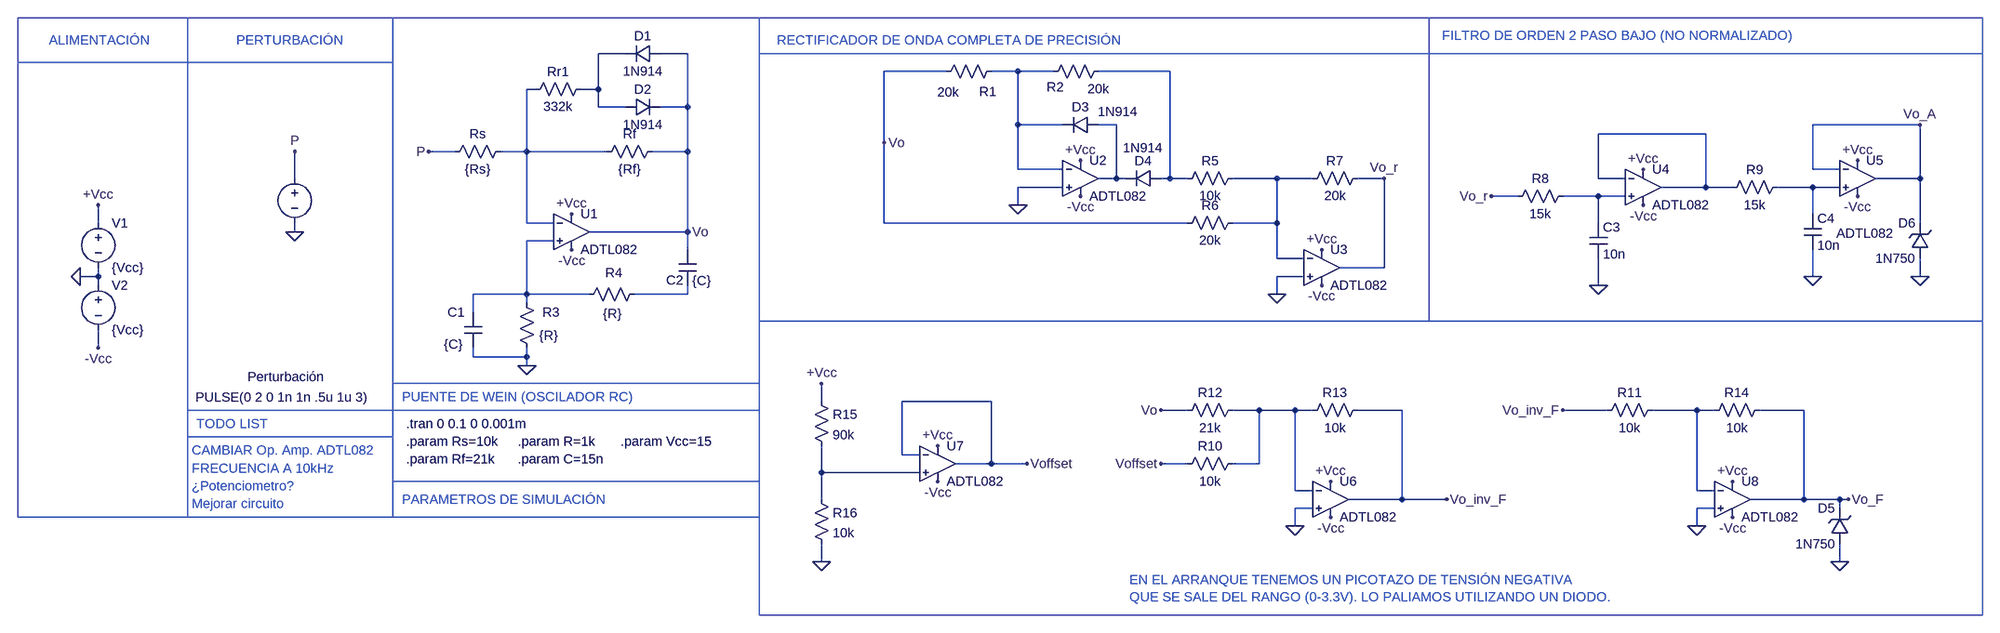
[diagram p0: schematic Circuito_Oscilador.asc]
Circuito_Oscilador.asc, the LTspice schematic file:
Version 4
SHEET 1 4436 1040
WIRE 432 -160 384 -160
WIRE 544 -160 496 -160
WIRE 1008 -128 896 -128
WIRE 1136 -128 1088 -128
WIRE 1200 -128 1136 -128
WIRE 1408 -128 1280 -128
WIRE 272 -96 256 -96
WIRE 384 -96 384 -160
WIRE 384 -96 352 -96
WIRE 384 -64 384 -96
WIRE 432 -64 384 -64
WIRE 544 -64 544 -160
WIRE 544 -64 496 -64
WIRE 1136 -32 1136 -128
WIRE 1216 -32 1136 -32
WIRE 1312 -32 1280 -32
WIRE 2752 -32 2560 -32
WIRE 2368 -16 2176 -16
WIRE 896 0 896 -128
WIRE 128 16 80 16
WIRE 256 16 256 -96
WIRE 256 16 208 16
WIRE 400 16 256 16
WIRE 544 16 544 -64
WIRE 544 16 480 16
WIRE 1136 48 1136 -32
WIRE 1216 48 1136 48
WIRE 2560 48 2560 -32
WIRE 2608 48 2560 48
WIRE -160 64 -160 16
WIRE 1312 64 1312 -32
WIRE 1312 64 1280 64
WIRE 1328 64 1312 64
WIRE 1408 64 1408 -128
WIRE 1408 64 1392 64
WIRE 1440 64 1408 64
WIRE 1600 64 1520 64
WIRE 1664 64 1600 64
WIRE 1792 64 1744 64
WIRE 2176 64 2176 -16
WIRE 2224 64 2176 64
WIRE 2752 64 2752 -32
WIRE 2752 64 2672 64
WIRE 1216 80 1136 80
WIRE 2368 80 2368 -16
WIRE 2368 80 2288 80
WIRE 2416 80 2368 80
WIRE 2560 80 2496 80
WIRE 2608 80 2560 80
WIRE 2032 96 1984 96
WIRE 2176 96 2112 96
WIRE 2224 96 2176 96
WIRE 1136 112 1136 80
WIRE 2560 128 2560 80
WIRE -512 144 -512 112
WIRE 256 144 256 16
WIRE 304 144 256 144
WIRE 896 144 896 0
WIRE 1440 144 896 144
WIRE 1600 144 1600 64
WIRE 1600 144 1520 144
WIRE 2176 144 2176 96
WIRE 2752 144 2752 64
WIRE -160 160 -160 144
WIRE 544 160 544 16
WIRE 544 160 368 160
WIRE 304 176 256 176
WIRE 544 192 544 160
WIRE 1600 208 1600 144
WIRE 1648 208 1600 208
WIRE 1792 224 1792 64
WIRE 1792 224 1712 224
WIRE -512 240 -512 224
WIRE -512 240 -544 240
WIRE 1648 240 1600 240
WIRE 2560 240 2560 192
WIRE 2752 240 2752 208
WIRE -512 256 -512 240
WIRE 2176 256 2176 208
WIRE 256 272 256 176
WIRE 256 272 160 272
WIRE 368 272 256 272
WIRE 544 272 544 256
WIRE 544 272 448 272
WIRE 1600 272 1600 240
WIRE 256 288 256 272
WIRE 160 304 160 272
WIRE -512 368 -512 336
WIRE 160 384 160 368
WIRE 256 384 256 368
WIRE 256 384 160 384
WIRE 256 400 256 384
WIRE 784 464 784 432
WIRE 1088 464 928 464
WIRE 1440 480 1392 480
WIRE 1568 480 1520 480
WIRE 1632 480 1568 480
WIRE 1664 480 1632 480
WIRE 1824 480 1744 480
WIRE 2192 480 2112 480
WIRE 2352 480 2272 480
WIRE 2384 480 2352 480
WIRE 2544 480 2464 480
WIRE 928 560 928 464
WIRE 960 560 928 560
WIRE 1088 576 1088 464
WIRE 1088 576 1024 576
WIRE 1152 576 1088 576
WIRE 1440 576 1392 576
WIRE 1568 576 1568 480
WIRE 1568 576 1520 576
WIRE 784 592 784 544
WIRE 960 592 784 592
WIRE 1632 624 1632 480
WIRE 1664 624 1632 624
WIRE 2352 624 2352 480
WIRE 2384 624 2352 624
WIRE 784 640 784 592
WIRE 1824 640 1824 480
WIRE 1824 640 1728 640
WIRE 1904 640 1824 640
WIRE 2544 640 2544 480
WIRE 2544 640 2448 640
WIRE 2608 640 2544 640
WIRE 2624 640 2608 640
WIRE 1664 656 1632 656
WIRE 2384 656 2352 656
WIRE 2608 656 2608 640
WIRE 1632 688 1632 656
WIRE 2352 688 2352 656
WIRE 784 752 784 720
WIRE 2608 752 2608 720
FLAG -544 240 0
FLAG -512 112 +Vcc
FLAG -512 368 -Vcc
FLAG 336 192 -Vcc
FLAG 336 128 +Vcc
FLAG 256 400 0
FLAG 544 160 Vo
FLAG -160 160 0
FLAG 80 16 P
FLAG -160 16 P
FLAG 1600 272 0
FLAG 1136 112 0
FLAG 1248 32 +Vcc
FLAG 1248 96 -Vcc
FLAG 1680 192 +Vcc
FLAG 1680 256 -Vcc
FLAG 1792 64 Vo_r
FLAG 2176 256 0
FLAG 2560 240 0
FLAG 2256 48 +Vcc
FLAG 2256 112 -Vcc
FLAG 2640 32 +Vcc
FLAG 2640 96 -Vcc
FLAG 1984 96 Vo_r
FLAG 2752 -32 Vo_A
FLAG 896 0 Vo
FLAG 1696 672 -Vcc
FLAG 1696 608 +Vcc
FLAG 1632 688 0
FLAG 992 608 -Vcc
FLAG 992 544 +Vcc
FLAG 784 752 0
FLAG 784 432 +Vcc
FLAG 1152 576 Voffset
FLAG 1392 576 Voffset
FLAG 1392 480 Vo
FLAG 1904 640 Vo_inv_F
FLAG 2416 672 -Vcc
FLAG 2416 608 +Vcc
FLAG 2352 688 0
FLAG 2624 640 Vo_F
FLAG 2112 480 Vo_inv_F
FLAG 2608 752 0
FLAG 2752 240 0
SYMBOL voltage -512 128 R0
WINDOW 123 0 0 Left 0
WINDOW 39 0 0 Left 0
SYMATTR InstName V1
SYMATTR Value {Vcc}
SYMBOL voltage -512 240 R0
WINDOW 123 0 0 Left 0
WINDOW 39 0 0 Left 0
SYMATTR InstName V2
SYMATTR Value {Vcc}
SYMBOL res 224 0 R90
WINDOW 0 0 56 VBottom 2
WINDOW 3 32 56 VTop 2
SYMATTR InstName Rs
SYMATTR Value {Rs}
SYMBOL res 496 0 R90
WINDOW 0 0 56 VBottom 2
WINDOW 3 32 56 VTop 2
SYMATTR InstName Rf
SYMATTR Value {Rf}
SYMBOL res 240 272 R0
WINDOW 0 44 32 Left 2
WINDOW 3 38 74 Left 2
SYMATTR InstName R3
SYMATTR Value {R}
SYMBOL cap 144 304 R0
WINDOW 0 -30 0 Left 2
WINDOW 3 -37 58 Left 2
SYMATTR InstName C1
SYMATTR Value {C}
SYMBOL cap 528 192 R0
WINDOW 0 -22 55 Left 2
SYMATTR InstName C2
SYMATTR Value {C}
SYMBOL res 464 256 R90
WINDOW 0 -7 52 VBottom 2
WINDOW 3 35 55 VTop 2
SYMATTR InstName R4
SYMATTR Value {R}
SYMBOL voltage -160 48 R0
WINDOW 0 -84 372 Left 2
WINDOW 3 -178 409 Left 2
WINDOW 123 0 0 Left 0
WINDOW 39 0 0 Left 0
SYMATTR InstName Perturbación
SYMATTR Value PULSE(0 2 0 1n 1n .5u 1u 3)
SYMBOL res 368 -112 R90
WINDOW 0 0 56 VBottom 2
WINDOW 3 32 56 VTop 2
SYMATTR InstName Rr1
SYMATTR Value 332k
SYMBOL diode 496 -176 R90
WINDOW 0 0 32 VBottom 2
WINDOW 3 32 32 VTop 2
SYMATTR InstName D1
SYMATTR Value 1N914
SYMBOL diode 432 -48 R270
WINDOW 0 32 32 VTop 2
WINDOW 3 0 32 VBottom 2
SYMATTR InstName D2
SYMATTR Value 1N914
SYMBOL OpAmps\\ADTL082 336 96 R0
SYMATTR InstName U1
SYMBOL OpAmps\\ADTL082 1248 0 R0
SYMATTR InstName U2
SYMBOL OpAmps\\ADTL082 1680 160 R0
SYMATTR InstName U3
SYMBOL res 1104 -144 R90
WINDOW 0 68 22 VBottom 2
WINDOW 3 38 93 VTop 2
SYMATTR InstName R1
SYMATTR Value 20k
SYMBOL res 1296 -144 R90
WINDOW 0 60 93 VBottom 2
WINDOW 3 32 16 VTop 2
SYMATTR InstName R2
SYMATTR Value 20k
SYMBOL res 1536 48 R90
WINDOW 0 0 56 VBottom 2
WINDOW 3 32 56 VTop 2
SYMATTR InstName R5
SYMATTR Value 10k
SYMBOL res 1536 128 R90
WINDOW 0 0 56 VBottom 2
WINDOW 3 32 56 VTop 2
SYMATTR InstName R6
SYMATTR Value 20k
SYMBOL res 1760 48 R90
WINDOW 0 0 56 VBottom 2
WINDOW 3 32 56 VTop 2
SYMATTR InstName R7
SYMATTR Value 20k
SYMBOL diode 1280 -48 R90
WINDOW 0 0 32 VBottom 2
WINDOW 3 -23 -35 VTop 2
SYMATTR InstName D3
SYMATTR Value 1N914
SYMBOL diode 1392 48 R90
WINDOW 0 0 32 VBottom 2
WINDOW 3 -54 32 VTop 2
SYMATTR InstName D4
SYMATTR Value 1N914
SYMBOL OpAmps\\ADTL082 2256 16 R0
SYMATTR InstName U4
SYMBOL cap 2160 144 R0
SYMATTR InstName C3
SYMATTR Value 10n
SYMBOL res 2128 80 R90
WINDOW 0 0 56 VBottom 2
WINDOW 3 32 56 VTop 2
SYMATTR InstName R8
SYMATTR Value 15k
SYMBOL OpAmps\\ADTL082 2640 0 R0
WINDOW 3 -38 163 Left 2
SYMATTR InstName U5
SYMBOL cap 2544 128 R0
SYMATTR InstName C4
SYMATTR Value 10n
SYMBOL res 2512 64 R90
WINDOW 0 0 56 VBottom 2
WINDOW 3 32 56 VTop 2
SYMATTR InstName R9
SYMATTR Value 15k
SYMBOL OpAmps\\ADTL082 1696 576 R0
SYMATTR InstName U6
SYMBOL res 1424 496 R270
WINDOW 0 32 56 VTop 2
WINDOW 3 0 56 VBottom 2
SYMATTR InstName R12
SYMATTR Value 21k
SYMBOL res 1648 496 R270
WINDOW 0 32 56 VTop 2
WINDOW 3 0 56 VBottom 2
SYMATTR InstName R13
SYMATTR Value 10k
SYMBOL OpAmps\\ADTL082 992 512 R0
SYMATTR InstName U7
SYMBOL res 768 448 R0
SYMATTR InstName R15
SYMATTR Value 90k
SYMBOL res 768 624 R0
SYMATTR InstName R16
SYMATTR Value 10k
SYMBOL res 1536 560 R90
WINDOW 0 0 56 VBottom 2
WINDOW 3 32 56 VTop 2
SYMATTR InstName R10
SYMATTR Value 10k
SYMBOL OpAmps\\ADTL082 2416 576 R0
SYMATTR InstName U8
SYMBOL res 2176 496 R270
WINDOW 0 32 56 VTop 2
WINDOW 3 0 56 VBottom 2
SYMATTR InstName R11
SYMATTR Value 10k
SYMBOL res 2368 496 R270
WINDOW 0 32 56 VTop 2
WINDOW 3 0 56 VBottom 2
SYMATTR InstName R14
SYMATTR Value 10k
SYMBOL zener 2624 720 R180
WINDOW 0 24 64 Left 2
WINDOW 3 24 0 Left 2
SYMATTR InstName D5
SYMATTR Value 1N750
SYMATTR Description Diode
SYMATTR Type diode
SYMBOL zener 2768 208 R180
WINDOW 0 24 64 Left 2
WINDOW 3 24 0 Left 2
SYMATTR InstName D6
SYMATTR Value 1N750
SYMATTR Description Diode
SYMATTR Type diode
TEXT 40 504 Left 2 !.tran 0 0.1 0 0.001m
TEXT 32 456 Left 2 ;PUENTE DE WEIN (OSCILADOR RC)
TEXT -600 -184 Left 2 ;ALIMENTACIÓN
TEXT -264 -184 Left 2 ;PERTURBACIÓN
TEXT 32 640 Left 2 ;PARAMETROS DE SIMULACIÓN
TEXT 40 536 Left 2 !.param Rs=10k
TEXT 40 568 Left 2 !.param Rf=21k
TEXT 240 536 Left 2 !.param R=1k
TEXT 240 568 Left 2 !.param C=15n
TEXT 424 536 Left 2 !.param Vcc=15
TEXT -336 504 Left 2 ;TODO LIST
TEXT -344 552 Left 2 ;CAMBIAR Op. Amp. ADTL082
TEXT -344 584 Left 2 ;FRECUENCIA A 10kHz
TEXT -344 616 Left 2 ;¿Potenciometro?
TEXT -344 648 Left 2 ;Mejorar circuito
TEXT 704 -184 Left 2 ;RECTIFICADOR DE ONDA COMPLETA DE PRECISIÓN
TEXT 1896 -192 Left 2 ;FILTRO DE ORDEN 2 PASO BAJO (NO NORMALIZADO)
TEXT 1336 784 Left 2 ;EN EL ARRANQUE TENEMOS UN PICOTAZO DE TENSIÓN NEGATIVA\nQUE SE SALE DEL RANGO (0-3.3V). LO PALIAMOS UTILIZANDO UN DIODO.
RECTANGLE Normal 672 480 16 432
RECTANGLE Normal 672 672 16 480
RECTANGLE Normal 672 672 16 608
RECTANGLE Normal 16 672 -352 480
RECTANGLE Normal 16 528 -352 480
RECTANGLE Normal 672 -224 16 432
RECTANGLE Normal -352 480 16 -224
RECTANGLE Normal 16 -144 -352 -224
RECTANGLE Normal -656 672 -352 -224
RECTANGLE Normal -352 -144 -656 -224
RECTANGLE Normal 1872 320 672 -224
RECTANGLE Normal 2864 320 1872 -224
RECTANGLE Normal 1872 -160 672 -224
RECTANGLE Normal 2864 -160 1872 -224
RECTANGLE Normal 2864 848 672 320

The netlist it stands for:
* Circuito_Oscilador.asc
V1 +Vcc 0 {Vcc}
V2 0 -Vcc {Vcc}
Rs N004 P {Rs}
Rf Vo N004 {Rf}
R3 N010 0 {R}
C1 N010 0 {C}
C2 Vo N011 {C}
R4 N011 N010 {R}
V§Perturbación P 0 PULSE(0 2 0 1n 1n .5u 1u 3)
Rr1 N001 N004 332k
D1 Vo N001 1N914
D2 N001 Vo 1N914
XU1 N010 N004 +Vcc -Vcc Vo ADTL082  ; pins In+ In- V+ V- OUT
XU2 0 N002 +Vcc -Vcc N005 ADTL082  ; pins In+ In- V+ V- OUT
XU3 0 N007 +Vcc -Vcc Vo_r ADTL082  ; pins In+ In- V+ V- OUT
R1 N002 Vo 20k
R2 N003 N002 20k
R5 N007 N003 10k
R6 N007 Vo 20k
R7 Vo_r N007 20k
D3 N005 N002 1N914
D4 N003 N005 1N914
XU4 N009 N006 +Vcc -Vcc N006 ADTL082  ; pins In+ In- V+ V- OUT
C3 N009 0 10n
R8 N009 Vo_r 15k
XU5 N008 Vo_A +Vcc -Vcc Vo_A ADTL082  ; pins In+ In- V+ V- OUT
C4 N008 0 10n
R9 N008 N006 15k
XU6 0 N012 +Vcc -Vcc Vo_inv_F ADTL082  ; pins In+ In- V+ V- OUT
R12 Vo N012 21k
R13 N012 Vo_inv_F 10k
XU7 N014 Voffset +Vcc -Vcc Voffset ADTL082  ; pins In+ In- V+ V- OUT
R15 +Vcc N014 90k
R16 N014 0 10k
R10 N012 Voffset 10k
XU8 0 N013 +Vcc -Vcc Vo_F ADTL082  ; pins In+ In- V+ V- OUT
R11 Vo_inv_F N013 10k
R14 N013 Vo_F 10k
D5 0 Vo_F 1N750
D6 0 Vo_A 1N750
.model D D
.lib standard.dio
.tran 0 0.1 0 0.001m
* PUENTE DE WEIN (OSCILADOR RC)
* ALIMENTACIÓN
* PERTURBACIÓN
* PARAMETROS DE SIMULACIÓN
.param Rs=10k
.param Rf=21k
.param R=1k
.param C=15n
.param Vcc=15
* TODO LIST
* CAMBIAR Op. Amp. ADTL082
* FRECUENCIA A 10kHz
* ¿Potenciometro?
* Mejorar circuito
* RECTIFICADOR DE ONDA COMPLETA DE PRECISIÓN
* FILTRO DE ORDEN 2 PASO BAJO (NO NORMALIZADO)
* EN EL ARRANQUE TENEMOS UN PICOTAZO DE TENSIÓN NEGATIVA
* QUE SE SALE DEL RANGO (0-3.3V). LO PALIAMOS UTILIZANDO UN DIODO.
.lib ADI.lib
.backanno
.end